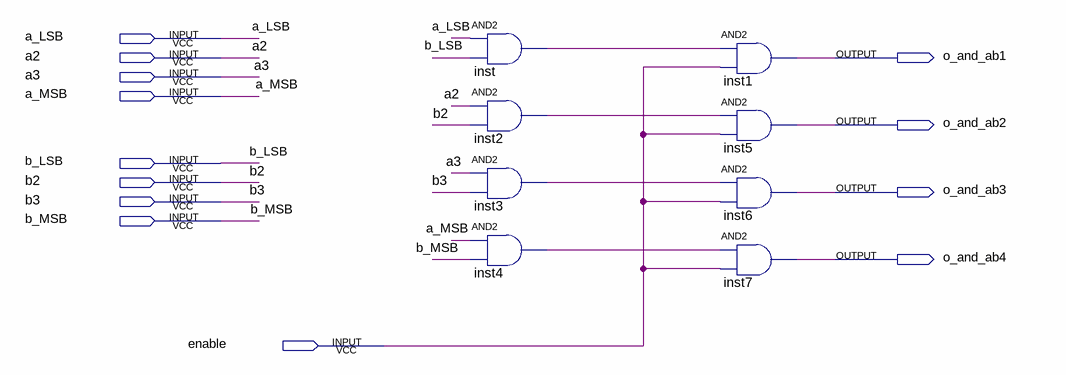
[diagram p0: schematic sheet]
// Quartus schematic full_and.bdf as structural Verilog: 8 symbols, 13 pins
module full_and (
  input  a_LSB,
  input  a2,
  input  a3,
  input  a_MSB,
  input  b_LSB,
  input  b2,
  input  b3,
  input  b_MSB,
  input  enable,
  output o_and_ab1,
  output o_and_ab2,
  output o_and_ab3,
  output o_and_ab4
);

  wire inst2_out, inst3_out, inst4_out, inst_out;

  and inst (inst_out, a_LSB, b_LSB);
  and inst2 (inst2_out, a2, b2);
  and inst3 (inst3_out, a3, b3);
  and inst4 (inst4_out, a_MSB, b_MSB);
  and inst1 (o_and_ab1, inst_out, enable);
  and inst5 (o_and_ab2, inst2_out, enable);
  and inst6 (o_and_ab3, inst3_out, enable);
  and inst7 (o_and_ab4, inst4_out, enable);
endmodule
